# EAGLE design OBCI32_RN42 (EAGLE 7.4.0)
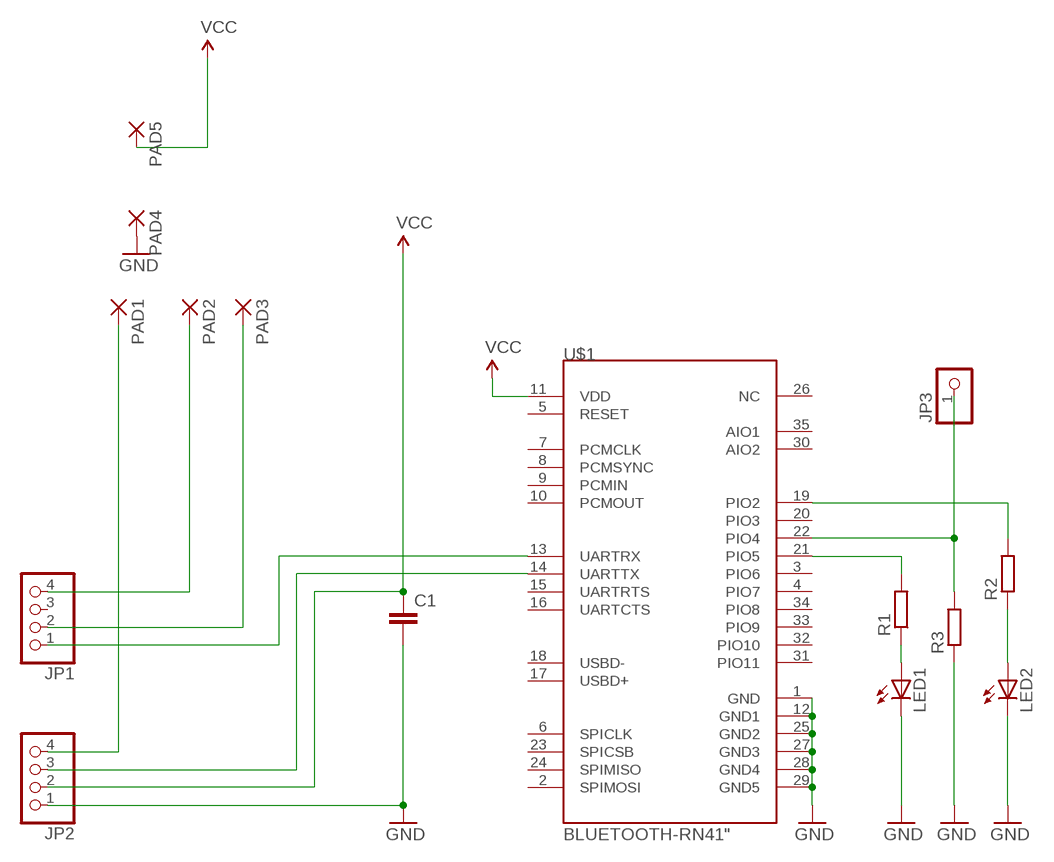
[diagram p0: schematic, sheet 1]

## Parts
C1  C-EUC0805  [C0805]
JP1  PINHD-1X4  [1X04]
JP2  PINHD-1X4  [1X04]
JP3  PINHD-1X1  [1X01]
LED1  LEDCHIP-LED0805  [CHIP-LED0805]
LED2  LEDCHIP-LED0805  [CHIP-LED0805]
PAD1  SMD2  [SMD1,27-2,54]
PAD2  SMD2  [SMD1,27-2,54]
PAD3  SMD2  [SMD1,27-2,54]
PAD4  SMD2  [SMD1,27-2,54]
PAD5  SMD2  [SMD1,27-2,54]
R1  R-EU_R0603  [R0603]
R2  R-EU_R0603  [R0603]
R3  R-EU_R0603  [R0603]
U$1  BLUETOOTH-RN41"  [RN41]

## Nets
GND: C1.2 JP2.1 LED1.C LED2.C PAD4.1(P) R3.1 U$1.1(GND) U$1.12(GND1) U$1.25(GND2) U$1.27(GND3) U$1.28(GND4) U$1.29(GND5)
N$1: R1.2 U$1.21(PIO5)
N$2: R2.2 U$1.19(PIO2)
N$3: JP2.3 U$1.14(UARTTX)
N$4: JP1.1 U$1.13(UARTRX)
N$5: LED1.A R1.1
N$7: JP1.2 PAD3.1(P)
N$8: JP1.4 PAD2.1(P)
N$9: JP2.4 PAD1.1(P)
N$10: LED2.A R2.1
N$11: JP3.1 R3.2 U$1.22(PIO4)
VCC: C1.1 JP2.2 PAD5.1(P) U$1.11(VDD)
Unconnected: JP1.3 U$1.2(SPIMOSI) U$1.3(PIO6) U$1.4(PIO7) U$1.5(RESET) U$1.6(SPICLK) U$1.7(PCMCLK) U$1.8(PCMSYNC) U$1.9(PCMIN) U$1.10(PCMOUT) U$1.15(UARTRTS) U$1.16(UARTCTS) U$1.17(USBD+) U$1.18(USBD-) U$1.20(PIO3) U$1.23(SPICSB) U$1.24(SPIMISO) U$1.26(NC) U$1.30(AIO2) U$1.31(PIO11) U$1.32(PIO10) U$1.33(PIO9) U$1.34(PIO8) U$1.35(AIO1)

## Library data of the parts
C1 = rcl:C-EU: CAPACITOR, European symbol
JP1 JP2 = pinhead:PINHD-1X4: PIN HEADER
JP3 = pinhead:PINHD-1X1: PIN HEADER
LED1 LED2 = adafruit:LED: LED OSRAM: - CHIPLED LG R971, LG N971, LY N971, LG Q971, LY Q971, LO R971, LY R971 LH N974, LH R974 LS Q976, LO Q976, LY Q976 LO Q996 - Hyper CHIPLED LW Q18S LB Q993, LB Q99A, LB R99A - SideLED LS A670, LO A670, LY A670, LG A670, LP A670 LB A673, LV A673, LT A673, LW A673 LH A674 LY A675 LS A676, LA A676, LO A676, LY A676, LW A676 LS A679, LY A679, LG A679 - Hyper Micro SIDELED® LS Y876, LA Y876, LO Y876, LY Y876 LT Y87S - SmartLED LW L88C, LW L88S LB L89C, LB L89S, LG L890 LS L89K, LO L89K, LY L89K LS L896, LA L896, LO L896, LY L896 - TOPLED LS T670, LO T670, LY T670, LG T670, LP T670 LSG T670, LSP T670, LSY T670, LOP T670, LYG T670 LG T671, LOG T671, LSG T671 LB T673, LV T673, LT T673, LW T673 LH T674 LS T676, LA T676, LO T676, LY T676, LB T676, LH T676, LSB T676, LW T676 LB T67C, LV T67C, LT T67C, LS T67K, LO T67K, LY T67K, LW E67C LS E67B, LA E67B, LO E67B, LY E67B, LB E67C, LV E67C, LT E67C LW T67C LS T679, LY T679, LG T679 LS T770, LO T770, LY T770, LG T770, LP T770 LB T773, LV T773, LT T773, LW T773 LH T774 LS E675, LA E675, LY E675, LS T675 LS T776, LA T776, LO T776, LY T776, LB T776 LHGB T686 LT T68C, LB T68C - Hyper Mini TOPLED® LB M676 - Mini TOPLED Santana® LG M470 LS M47K, LO M47K, LY M47K Source: http://www.osram.convergy.de/
PAD1-PAD5 = wirepad:SMD2: SMD PAD
R1-R3 = rcl:R-EU_: RESISTOR, European symbol
U$1 = ScratchPad:BLUETOOTH-RN41

## Board
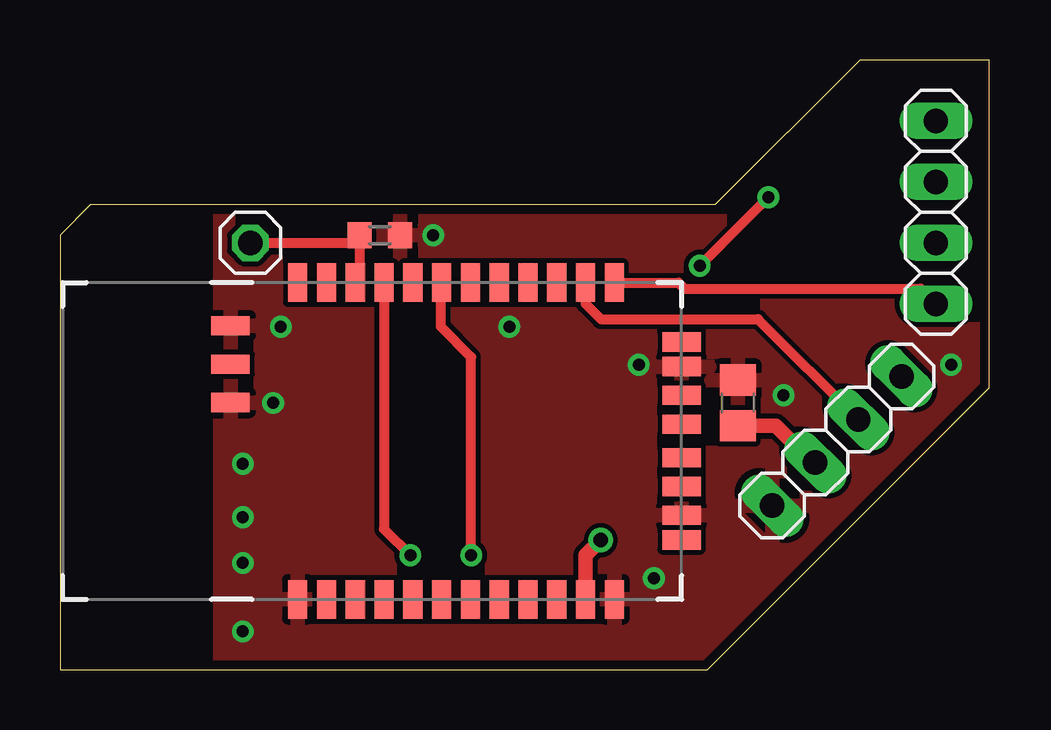
[diagram p1: board, top side]
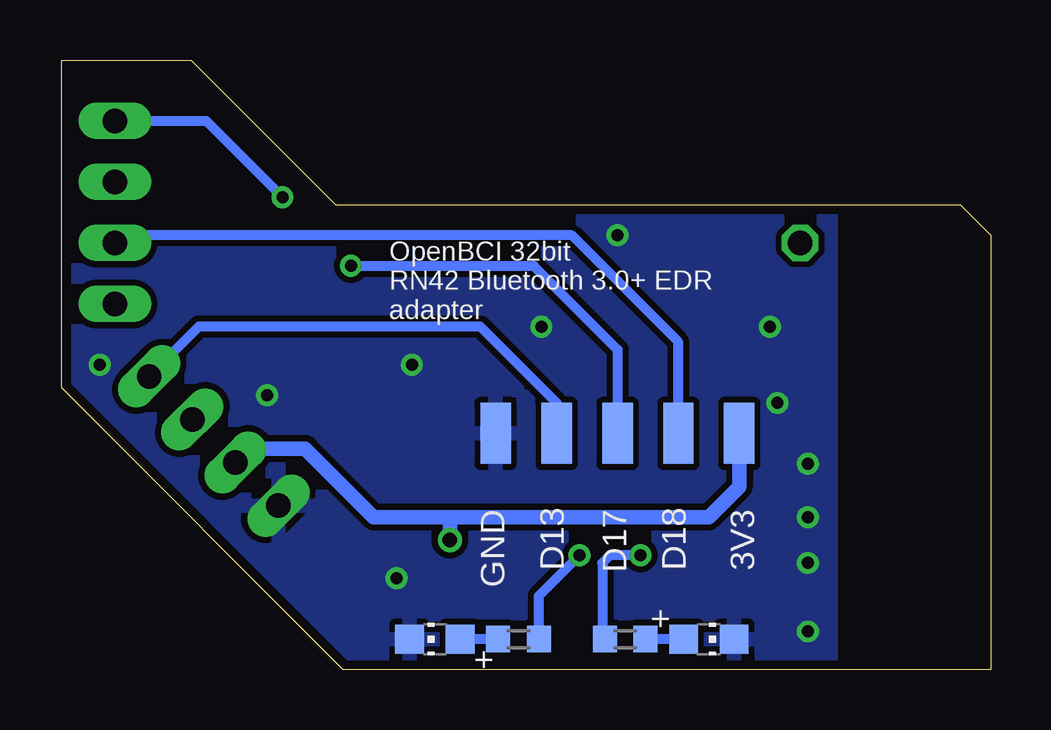
[diagram p2: board, bottom side, seen from below]

Size 38.73 x 25.4 mm. Coordinates in mm from the lower left corner, seen from the top.
Outline: 0,0 26.99,0 38.74,11.75 38.74,25.4 33.34,25.4 27.3,19.37 1.27,19.37 0,18.1 0,0
Copper layers (1*16): Top 0.035mm / dielectric 1.5mm / Bottom 0.035mm
Design rules "default *": minimum track width 10mil, minimum drill 24mil, track to track 8mil, track to pad 8mil, pad to pad 8mil, via to via 8mil, smd to smd 8mil, copper to edge 15mil, drill to drill 8mil, minimum pad ring 10mil, minimum via ring 8mil, stop-mask expansion 4mil, vias tented up to drill 20mil, thermal gap 10mil

### Footprints (pad centres in the part's own frame; a part is rotated, then mirrored left to right if it is on the bottom)
C0805 = smd 1.3 x 1.5: 1 -0.95,0; 2 0.95,0
1X04 = drill 1.016 long: 1 -3.81,0; 2 -1.27,0; 3 1.27,0; 4 3.81,0
1X01 = drill 1.016 octagon: 1 0,0
CHIP-LED0805 = smd 1.2 x 1.2: A 0,-1.05; C 0,1.05
SMD1,27-2,54 = smd 1.27 x 2.54: 1 0,0
R0603 = smd 1 x 1.1: 1 -0.85,0; 2 0.85,0
RN41 = smd 0.8 x 1.6: 1 -6.6,-6.6; 2 -5.4,-6.6; 3 -4.2,-6.6; 4 -3,-6.6; 5 -1.8,-6.6; 6 -0.6,-6.6; 7 0.6,-6.6; 8 1.8,-6.6; 9 3,-6.6; 10 4.2,-6.6; 11 5.4,-6.6; 12 6.6,-6.6; 13 6.6,6.6; 14 5.4,6.6; 15 4.2,6.6; 16 3,6.6; 17 1.8,6.6; 18 0.6,6.6; 19 -0.6,6.6; 20 -1.8,6.6; 21 -3,6.6; 22 -4.2,6.6; 23 -5.4,6.6; 24 -6.6,6.6 | smd 1.6 x 0.8: 25 -9.4,4.8; 26 -9.4,3.2; 27 -9.4,1.6; 28 9.4,3.1; 29 9.4,-3.1; 30 9.4,-4.122; 31 9.4,-1.9; 32 9.4,-0.7; 33 9.4,0.7; 34 9.4,1.9; 35 9.4,4.122

### Placement (x,y rotation side)
C1  28.26,11.11 90 top
JP1  36.51,19.05 90 top
JP2  32.38,9.53 45 top
JP3  7.94,17.78 0 top
LED1  11.75,1.27 270 bottom
LED2  23.18,1.27 90 bottom
PAD1  18.1,9.84 0 bottom
PAD2  15.56,9.84 0 bottom
PAD3  13.02,9.84 0 bottom
PAD4  20.64,9.84 0 bottom
PAD5  10.48,9.84 0 bottom
R1  15.24,1.27 180 bottom
R2  19.69,1.27 0 bottom
R3  13.33,18.1 180 top
U$1  16.51,9.53 0 top

### Tracks (layer width: path | path; a pad name or v marks a point on that pad's centre or on a via)
GND  (via drill 0.5)
  other vias: 37.15,12.7 30.16,11.43 15.56,18.1 7.62,4.45 7.62,6.35 7.62,8.57 7.62,1.59 9.21,14.29 8.89,11.11 24.77,3.81 24.13,12.7 18.73,14.29
  pour Top: 6.67,27.94 6.67,-5.08 44.13,-5.08 44.13,27.94
  pour Bottom (isolate 0.254): 6.67,26.67 6.67,-2.54 41.59,-2.54 41.59,26.67
N$1  (via drill 0.5)
  Top 0.406: U$1.21 13.51,5.86 v14.6,4.76
  Bottom 0.406: v14.6,4.76 15.87,4.76 16.19,4.44 16.19,1.37 R1.2
N$2  (via drill 0.5)
  Top 0.406: v17.14,4.76 17.14,13.02 15.87,14.29 15.87,16.09 U$1.19
  Bottom 0.406: R2.2 18.83,3.07 v17.14,4.76
N$3
  Top 0.406: U$1.14 21.91,15.24 22.54,14.6 29.1,14.6 JP2.3
N$4
  Top 0.406: U$1.13 25.78,16.12 26.03,15.87 35.88,15.87 JP1.1
N$5
  Bottom 0.406: LED1.A R1.1
N$7
  Bottom 0.406: PAD3.1 13.02,13.65 17.46,18.1 36.2,18.1 JP1.2
N$8  (via drill 0.5)
  Top 0.406: v29.53,19.69 v26.67,16.83
  Bottom 0.406: JP1.4 32.7,22.86 v29.53,19.69 | v26.67,16.83 19.05,16.83 15.56,13.34 PAD2.1
N$9
  Bottom 0.406: PAD1.1 18.1,11.11 21.27,14.29 33.01,14.29 JP2.4
N$10
  Bottom 0.406: R2.1 LED2.A
N$11
  Top 0.406: JP3.1 12.17,17.78 R3.2 12.49,16.3 U$1.22
VCC  (via drill 0.6)
  Top 0.61: JP2.2 31.38,8.63 29.85,10.16 C1.1 | U$1.11 21.91,4.77 v22.54,5.4
  Bottom 0.61: PAD5.1 10.48,7.62 11.75,6.35 22.54,6.35 | 22.54,6.35 25.72,6.35 28.57,9.21 30.91,9.21 JP2.2 | v22.54,5.4 22.54,6.35

### Text on the board
bPlace: OpenBCI 32bit / RN42 Bluetooth 3.0+ EDR / adapter | D17 | GND | 3V3 | D18 | D13